# EAGLE design Arduino-WiFi-Shield v1.0 (EAGLE 5.11)
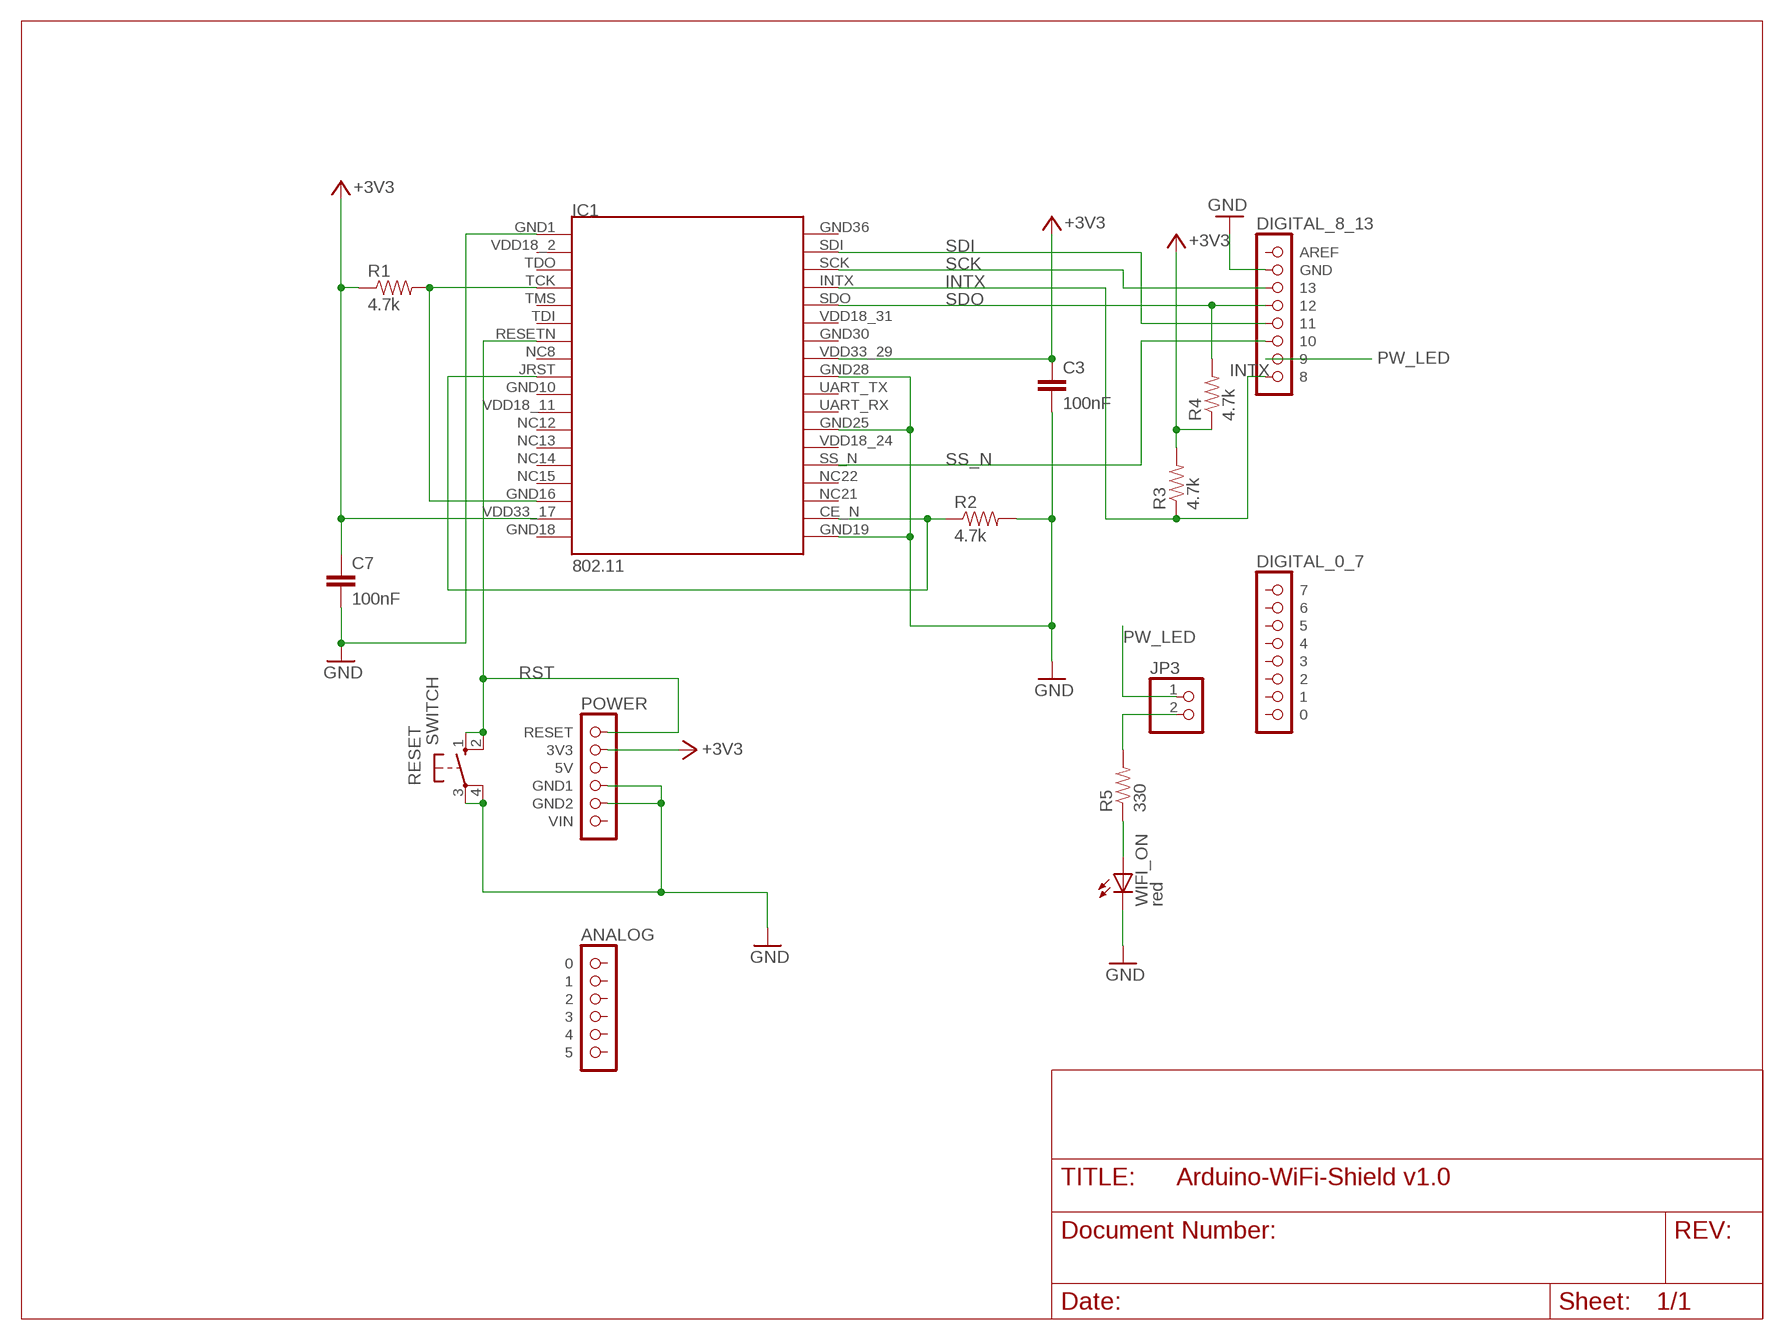
[diagram p0: schematic, sheet 1]

## Parts
C3  100nF  CAPACITOR0603-CAP  [0603-CAP]
C7  100nF  CAPACITOR0603-CAP  [0603-CAP]
IC1  802.11  ZG2100MOD  [ZG2100MOD]
JP3  PINHD2  [PINHD2]
R1  4.7k  RESISTOR0603-RES  [0603-RES]
R2  4.7k  RESISTOR0603-RES  [0603-RES]
R3  4.7k  RESISTOR0603-RES  [0603-RES]
R4  4.7k  RESISTOR0603-RES  [0603-RES]
R5  330  RESISTOR0603-RES  [0603-RES]
RESET  SWITCH  [SWITCH]
U$1  POWER  [1X06]
U$2  ANALOG  [1X06]
U$3  DIGITAL_0_7  [1X08]
U$4  DIGITAL_8_13  [1X08]
WIFI_ON  red  LED0603  [LED-0603]

## Nets
+3V3: C3.1 C7.1 IC1.VDD33_17 IC1.VDD33_29 R1.1 R3.2 R4.1 U$1.2(3V3)
CE_N: IC1.CE_N IC1.JRST R2.1
GND: C3.2 C7.2 IC1.GND1 IC1.GND19 IC1.GND25 IC1.GND28 R2.2 RESET.3(P) RESET.4(P1) U$1.4(GND1) U$1.5(GND2) U$4.2(GND) WIFI_ON.C
INTX: IC1.INTX R3.1 U$4.8
N$1: JP3.2 R5.2
N$2: R5.1 WIFI_ON.A
PW_LED: JP3.1 U$4.7
RST: IC1.RESETN(RSTN) RESET.1(S) RESET.2(S1) U$1.1(RESET)
SCK: IC1.SCK U$4.3
SDI: IC1.SDI U$4.5
SDO: IC1.SDO R4.2 U$4.4
SS_N: IC1.SS_N U$4.6
VDD_TIE: IC1.GND16 IC1.TCK R1.2
Unconnected: IC1.GND36 IC1.NC8 IC1.NC12 IC1.NC13 IC1.NC14 IC1.NC15 IC1.NC21 IC1.NC22 IC1.TDI IC1.TDO IC1.TMS IC1.UART_RX IC1.UART_TX IC1.VDD18_2 IC1.VDD18_11 IC1.VDD18_24 IC1.VDD18_31 U$1.3(5V) U$1.6(VIN) U$2.1 U$2.2 U$2.3 U$2.4 U$2.5 U$2.6 U$3.1 U$3.2 U$3.3 U$3.4 U$3.5 U$3.6 U$3.7 U$3.8 U$4.1(AREF)

## Power pins joined to a net without a drawn wire
GND10: IC1.GND10
GND18: IC1.GND18
GND30: IC1.GND30

## Library data of the parts
C3 C7 = asynlabs:CAPACITOR: Capacitor Standard 0603 ceramic capacitor, and 0.1" leaded capacitor.
IC1 = ZGLIB:ZG2100MOD: ZG2100 Module
JP3 = ZGLIB:PINHD2
R1-R5 = asynlabs:RESISTOR: Resistor Basic schematic elements and footprints for 0603, 1206, and PTH 1/10th watt (small) resistors.
RESET = asynlabs:SWITCH
U$1 = arduino:POWER
U$2 = arduino:ANALOG
U$3 = arduino:DIGITAL_0_7
U$4 = arduino:DIGITAL_8_13
WIFI_ON = asynlabs:LED: LEDs Standard schematic elements and footprints for 5mm, 3mm, 1206, and 0603 sized LEDs. 5mm - Spark Fun Electronics SKU : COM-00529 (and others)

## Board
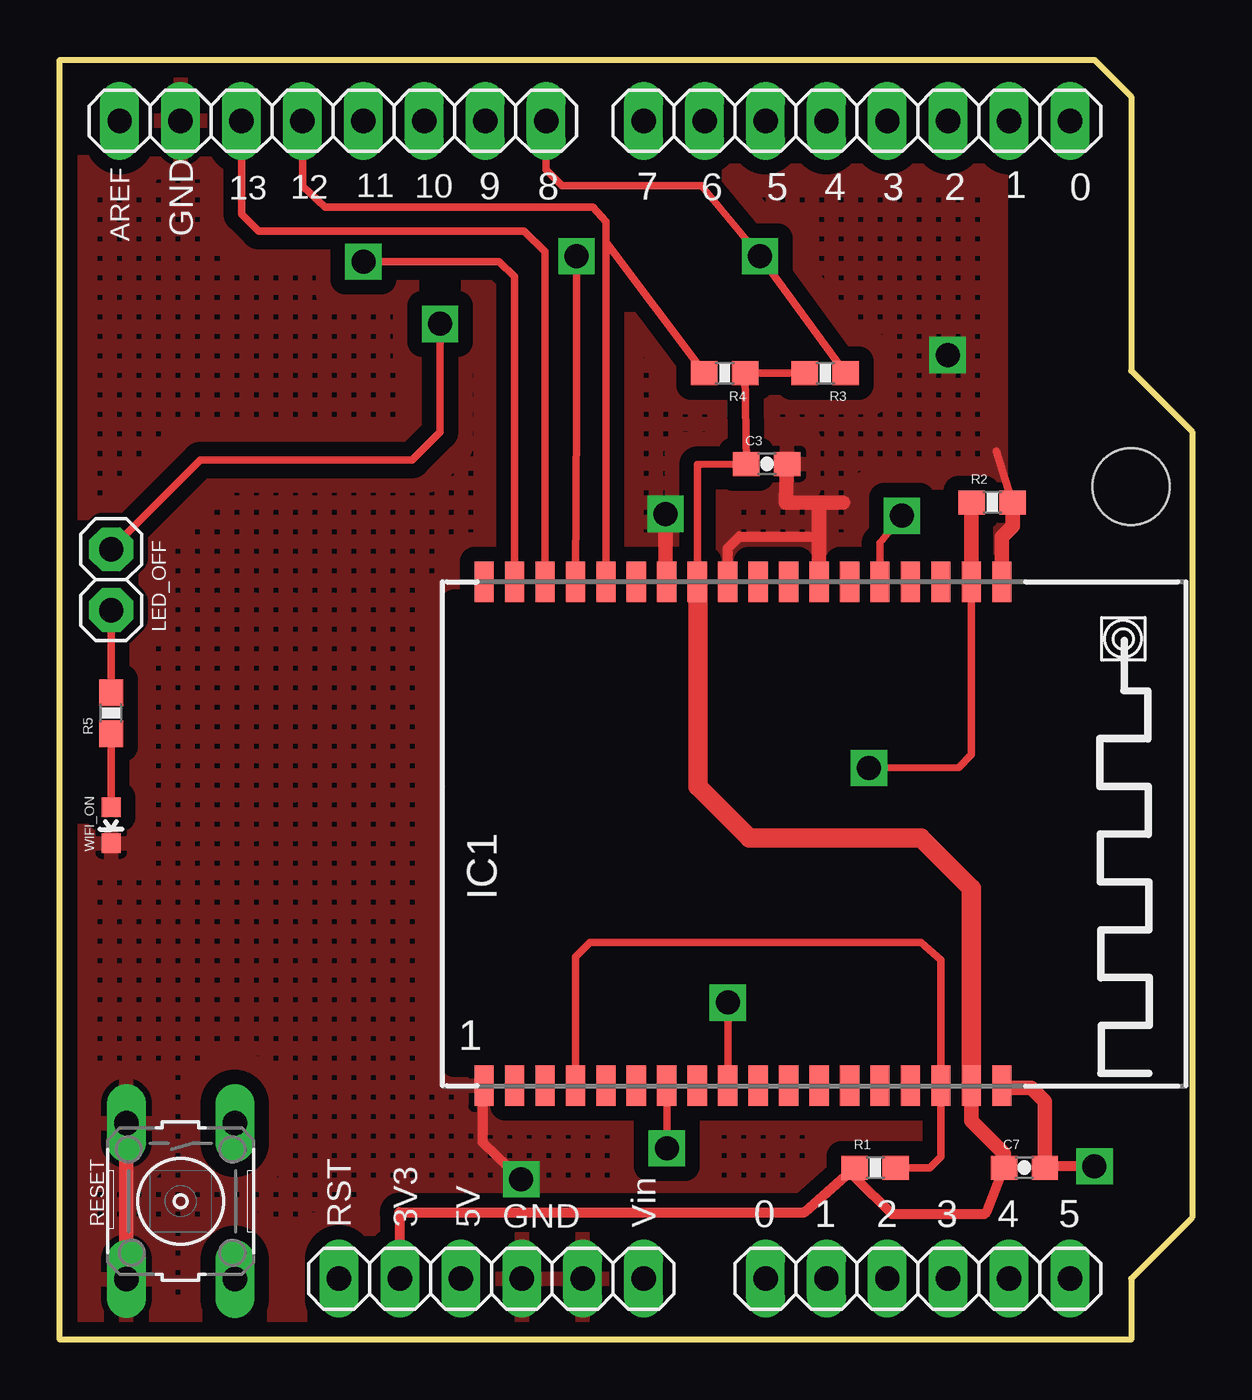
[diagram p1: board, top side]
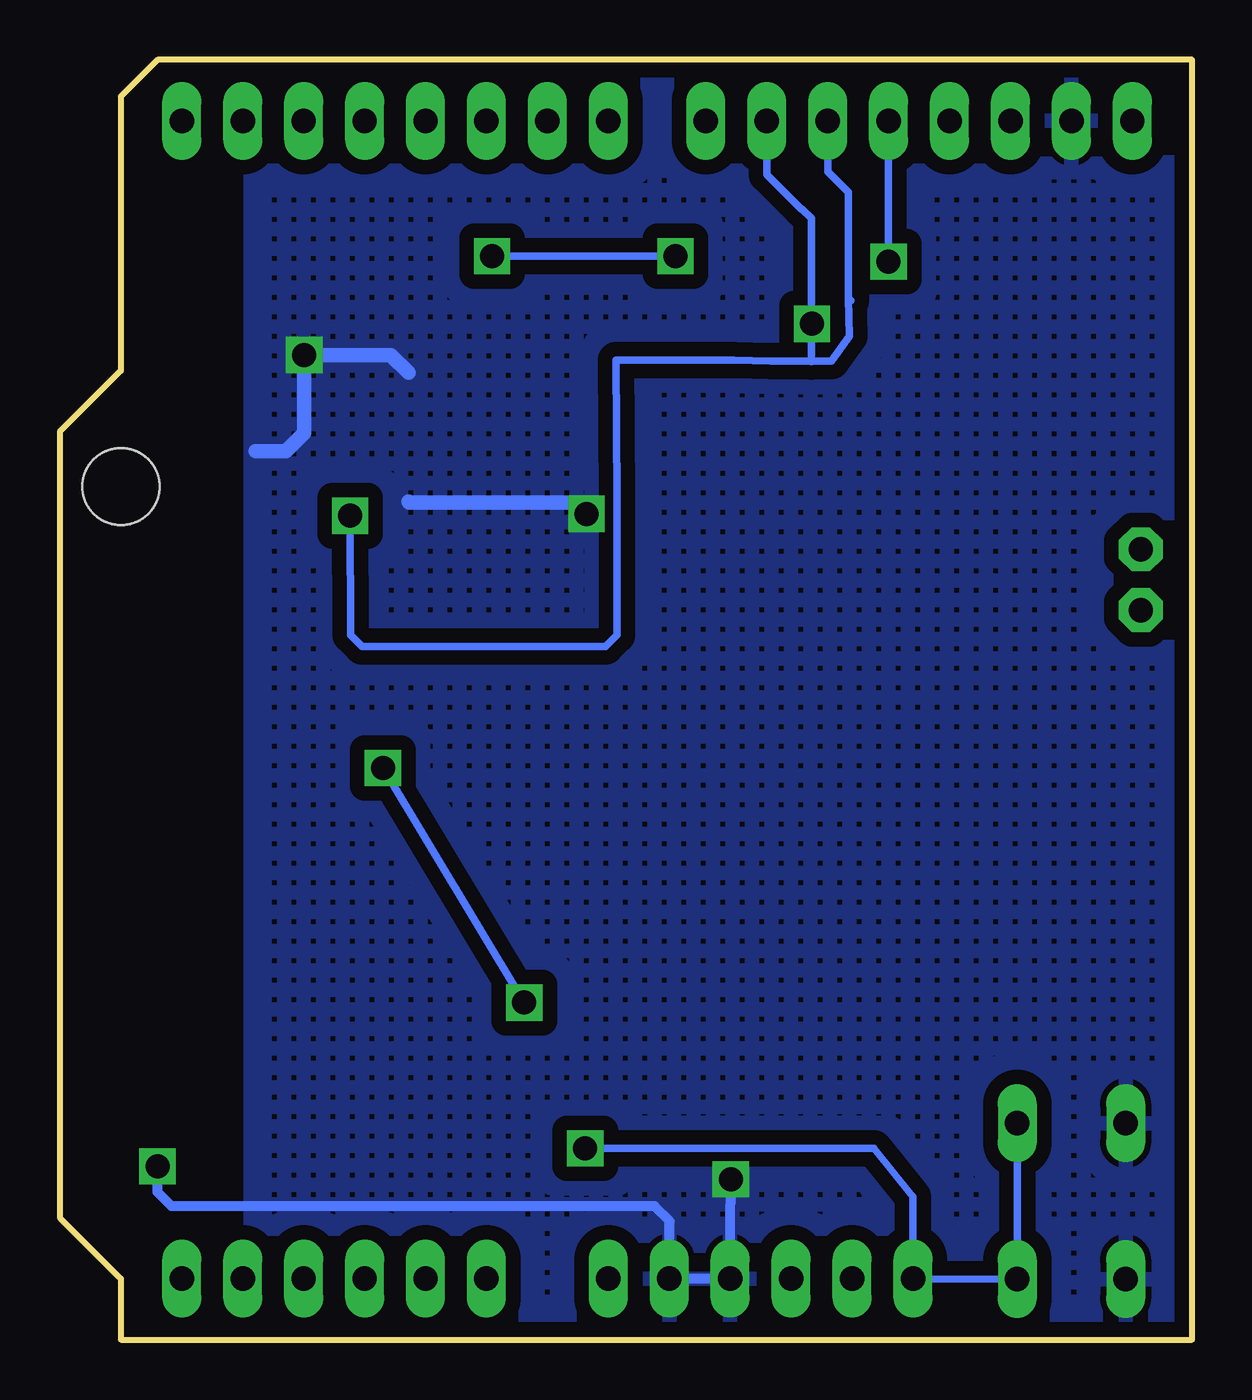
[diagram p2: board, bottom side, seen from below]

Size 47.19 x 53.34 mm. Coordinates in mm from the lower left corner, seen from the top.
Outline: 0,53.34 43.13,53.34 44.65,51.82 44.65,40.39 47.19,37.85 47.19,5.08 44.65,2.54 44.65,0 0,0 0,53.34
Copper layers (1*16): Top 0.035mm / dielectric 1.5mm / Bottom 0.035mm
Design rules "SparkFun *": minimum track width 8mil, minimum drill 16mil, track to track 8mil, track to pad 8mil, pad to pad 8mil, via to via 8mil, smd to smd 8mil, copper to edge 10mil, drill to drill 8mil, minimum pad ring 12mil, minimum via ring 10mil, stop-mask expansion 4mil, vias tented up to drill 25mil, thermal gap 10mil
Holes 3.2 mm at 44.65,35.56
tKeepout: area 39.9,30.7 to 46.8,31.7; area 39.8,10.4 to 46.8,11.5
tRestrict: area 16.5,11.6 to 47.2,30.7

### Footprints (pad centres in the part's own frame; a part is rotated, then mirrored left to right if it is on the bottom)
0603-CAP = smd 1.1 x 1: 1 -0.85,0; 2 0.85,0
ZG2100MOD = smd 0.8 x 1.7: CE_N 6.63,10.12; GND1 -13.69,-10.88; GND10 -2.26,-10.88; GND16 5.36,-10.88; GND18 7.9,-10.88; GND19 7.9,10.12; GND25 0.28,10.12; GND28 -3.53,10.12; GND30 -6.07,10.12; GND36 -13.69,10.12; INTX -9.88,10.12; JRST -3.53,-10.88; NC8 -4.8,-10.88; NC12 0.28,-10.88; NC13 1.55,-10.88; NC14 2.82,-10.88; NC15 4.09,-10.88; NC21 5.36,10.12; NC22 4.09,10.12; RESETN -6.07,-10.88; SCK -11.15,10.12; SDI -12.42,10.12; SDO -8.61,10.12; SS_N 2.82,10.12; TCK -9.88,-10.88; TDI -7.34,-10.88; TDO -11.15,-10.88; TMS -8.61,-10.88; UART_RX -0.99,10.12; UART_TX -2.26,10.12; VDD18_2 -12.42,-10.88; VDD18_11 -0.99,-10.88; VDD18_24 1.55,10.12; VDD18_31 -7.34,10.12; VDD33_17 6.63,-10.88; VDD33_29 -4.8,10.12
PINHD2 = drill 1.016 pad 1.829 octagon: 1 -1.27,0; 2 1.27,0
0603-RES = smd 1.1 x 1: 1 -0.85,0; 2 0.85,0
SWITCH = drill 1.016 long: 1 -3.251,2.261; 2 3.251,2.261; 3 -3.251,-2.261; 4 3.251,-2.261
1X06 = drill 1.016 long: 1 -6.35,0; 2 -3.81,0; 3 -1.27,0; 4 1.27,0; 5 3.81,0; 6 6.35,0
1X08 = drill 1.016 long: 1 -8.89,0; 2 -6.35,0; 3 -3.81,0; 4 -1.27,0; 5 1.27,0; 6 3.81,0; 7 6.35,0; 8 8.89,0
LED-0603 = smd 0.8 x 0.8: A 0,-0.75; C 0,0.75

### Placement (x,y rotation side)
C3  29.46,36.5 0 top
C7  40.21,7.16 0 top
IC1  31.37,21.46 0 top
JP3  2.13,31.67 270 top
R1  33.99,7.16 0 top
R2  38.86,34.9 0 top
R3  31.9,40.28 180 top
R4  27.71,40.28 180 top
R5  2.13,26.11 90 top
RESET  5.03,5.77 270 top
U$1  17.98,2.54 0 top
U$2  35.76,2.54 0 top
U$3  33.22,50.8 0 top
U$4  11.38,50.8 0 top
WIFI_ON  2.13,21.44 180 top

### Tracks (layer width: path | path; a pad name or v marks a point on that pad's centre or on a via)
+3V3
  Top 0.305: R3.2 R4.1 C3.1 26.57,36.47 IC1.VDD33_29
  Top 0.406: U$1.2 14.17,5.11 14.15,5.31 31.05,5.31 R1.1 33.14,6.77 34.67,5.23 38.53,5.23 38.63,5.33 C7.1
  Top 0.61: C7.1 39.36,7.76 38,9.12 IC1.VDD33_17 | 26.59,31.56 IC1.VDD33_29
  Top 0.813: IC1.VDD33_17 38,18.8 35.89,20.9 28.75,20.9 26.59,23.06 26.59,26.26 26.59,31.56
CE_N  (via drill 1)
  Top 0.305: IC1.CE_N 38,24.79 38,24.38 37.47,23.85 v33.73,23.83 | IC1.JRST v27.84,14.05
  Top 0.61: IC1.JRST | IC1.CE_N 38,34.89 R2.1
  Bottom 0.305: v27.84,14.05 v33.73,23.83
GND  (via drill 1)
  Top 0.203: C7.2 41.07,7.16 41.07,7.21
  Top 0.305: R2.2 39.04,37.03
  Top 0.406: 40.45,10.58 41.05,9.98 41.05,7.21 41.07,7.21 v43.13,7.21 | IC1.GND28 27.84,32.99 28.32,33.48 31.44,33.48 31.65,33.17 | v19.23,6.68 17.63,8.2 17.63,10.53 IC1.GND1
  Top 0.61: C7.2 41.06,9.92 40.49,10.49 39.36,10.49 | IC1.GND1 | RESET.4 RESET.3 | IC1.GND19 39.27,33.45 39.73,33.91 39.73,34.89 R2.2 | 31.65,34.9 31.65,33.17 IC1.GND25 | 31.65,34.9 | 31.65,34.9 31.52,34.9 | 31.52,34.9 30.26,34.9 C3.2 | 32.64,34.9 31.52,34.9 | 25.25,31.63 v25.25,34.42
  Bottom 0.406: v43.13,7.21 43.13,6.15 42.55,5.56 22.4,5.56 21.77,4.93 21.79,4.93 U$1.5 U$1.4 v19.23,6.68
  Bottom 0.61: 32.66,40.31 33.4,41.05 v37.01,41.05 37.01,37.8 37.77,37.03 39.04,37.03 | 32.66,34.93 32.64,34.9 25.73,34.9 v25.25,34.42
  pour Bottom (isolate 0.61, hatched): 0.08,53.39 39.24,53.39 39.24,0.1 0.08,0.1 0.08,2.26 0,2.26 0,53.47
  pour Top (isolate 0.61, hatched): 0.05,53.37 39.22,53.37 39.22,0.08 0.05,0.08 0.05,2.24 -0.03,2.24 -0.03,53.44
INTX  (via drill 1)
  Top 0.305: IC1.INTX 21.54,38.61 v21.54,45.16 | U$4.8 20.27,48.77 20.93,48.11 26.75,48.11 v29.18,45.16 R3.1
  Bottom 0.305: v21.54,45.16 25.6,45.16 v29.18,45.16
N$1
  Top 0.305: 2.15,30.39 JP3.2 R5.2
N$2
  Top 0.305: WIFI_ON.A R5.1
PW_LED  (via drill 1)
  Top 0.305: v15.85,42.34 15.85,37.82 14.68,36.65 5.84,36.65 JP3.1
  Bottom 0.305: v15.85,42.34 15.88,40.77 15.88,46.74 16.26,47.12 16.28,47.12 17.73,48.57 U$4.7
RST  (via drill 1)
  Top 0.305: v25.3,7.98 IC1.RESETN
  Bottom 0.305: 25.25,7.85 v25.3,7.98 13.26,7.98 11.63,5.94 U$1.1 RESET.2 RESET.1
SCK
  Top 0.305: IC1.SCK 20.22,42.55 20.22,45.34 19.36,46.2 8.28,46.2 7.57,46.91 U$4.3
SDI  (via drill 1)
  Top 0.305: IC1.SDI 18.95,44.3 | 18.95,44.3 18.31,44.93 v12.65,44.93 | 18.95,44.3 18.95,43.77 18.95,43.76
  Bottom 0.305: v12.65,44.93 U$4.5
SDO
  Top 0.305: IC1.SDO 22.76,45.42 | 22.76,45.42 22.76,45.62 | 22.76,45.42 22.76,45.62 | U$4.4 10.11,48.08 11.05,47.19 22.23,47.19 22.76,46.61 22.76,45.75 | 22.76,45.62 22.76,45.75 | 22.76,45.75 R4.2
SS_N  (via drill 1)
  Top 0.305: IC1.SS_N 34.19,33.2 v35.1,34.34
  Bottom 0.305: U$4.6 15.19,48.69 14.33,47.83 14.33,43.41 | 14.33,43.41 14.22,43.31 | 14.33,43.41 14.28,41.83 15.04,40.79 17.55,40.79 19.1,40.82 24,40.82 23.98,35.13 23.98,29.36 24.46,28.88 34.6,28.88 35.08,29.36 v35.1,34.34
VDD_TIE
  Top 0.305: R1.2 36.27,7.16 36.73,7.62 IC1.GND16 36.73,15.82 35.89,16.56 22.17,16.56 22.1,16.56 21.49,15.95 IC1.TCK

### Text on the board
tNames: 13 | 12 | 11 | 10 | 9 | 8 | 6 | 5 | 4 | 3 | 2 | 1 | 0 | 7 | AREF | GND | LED_OFF | GND | RST | 3V3 | 5V | Vin | 0 | 1 | 2 | 3 | 4 | 5